# EAGLE design Rear ECU rev5 (EAGLE 8.4.1)
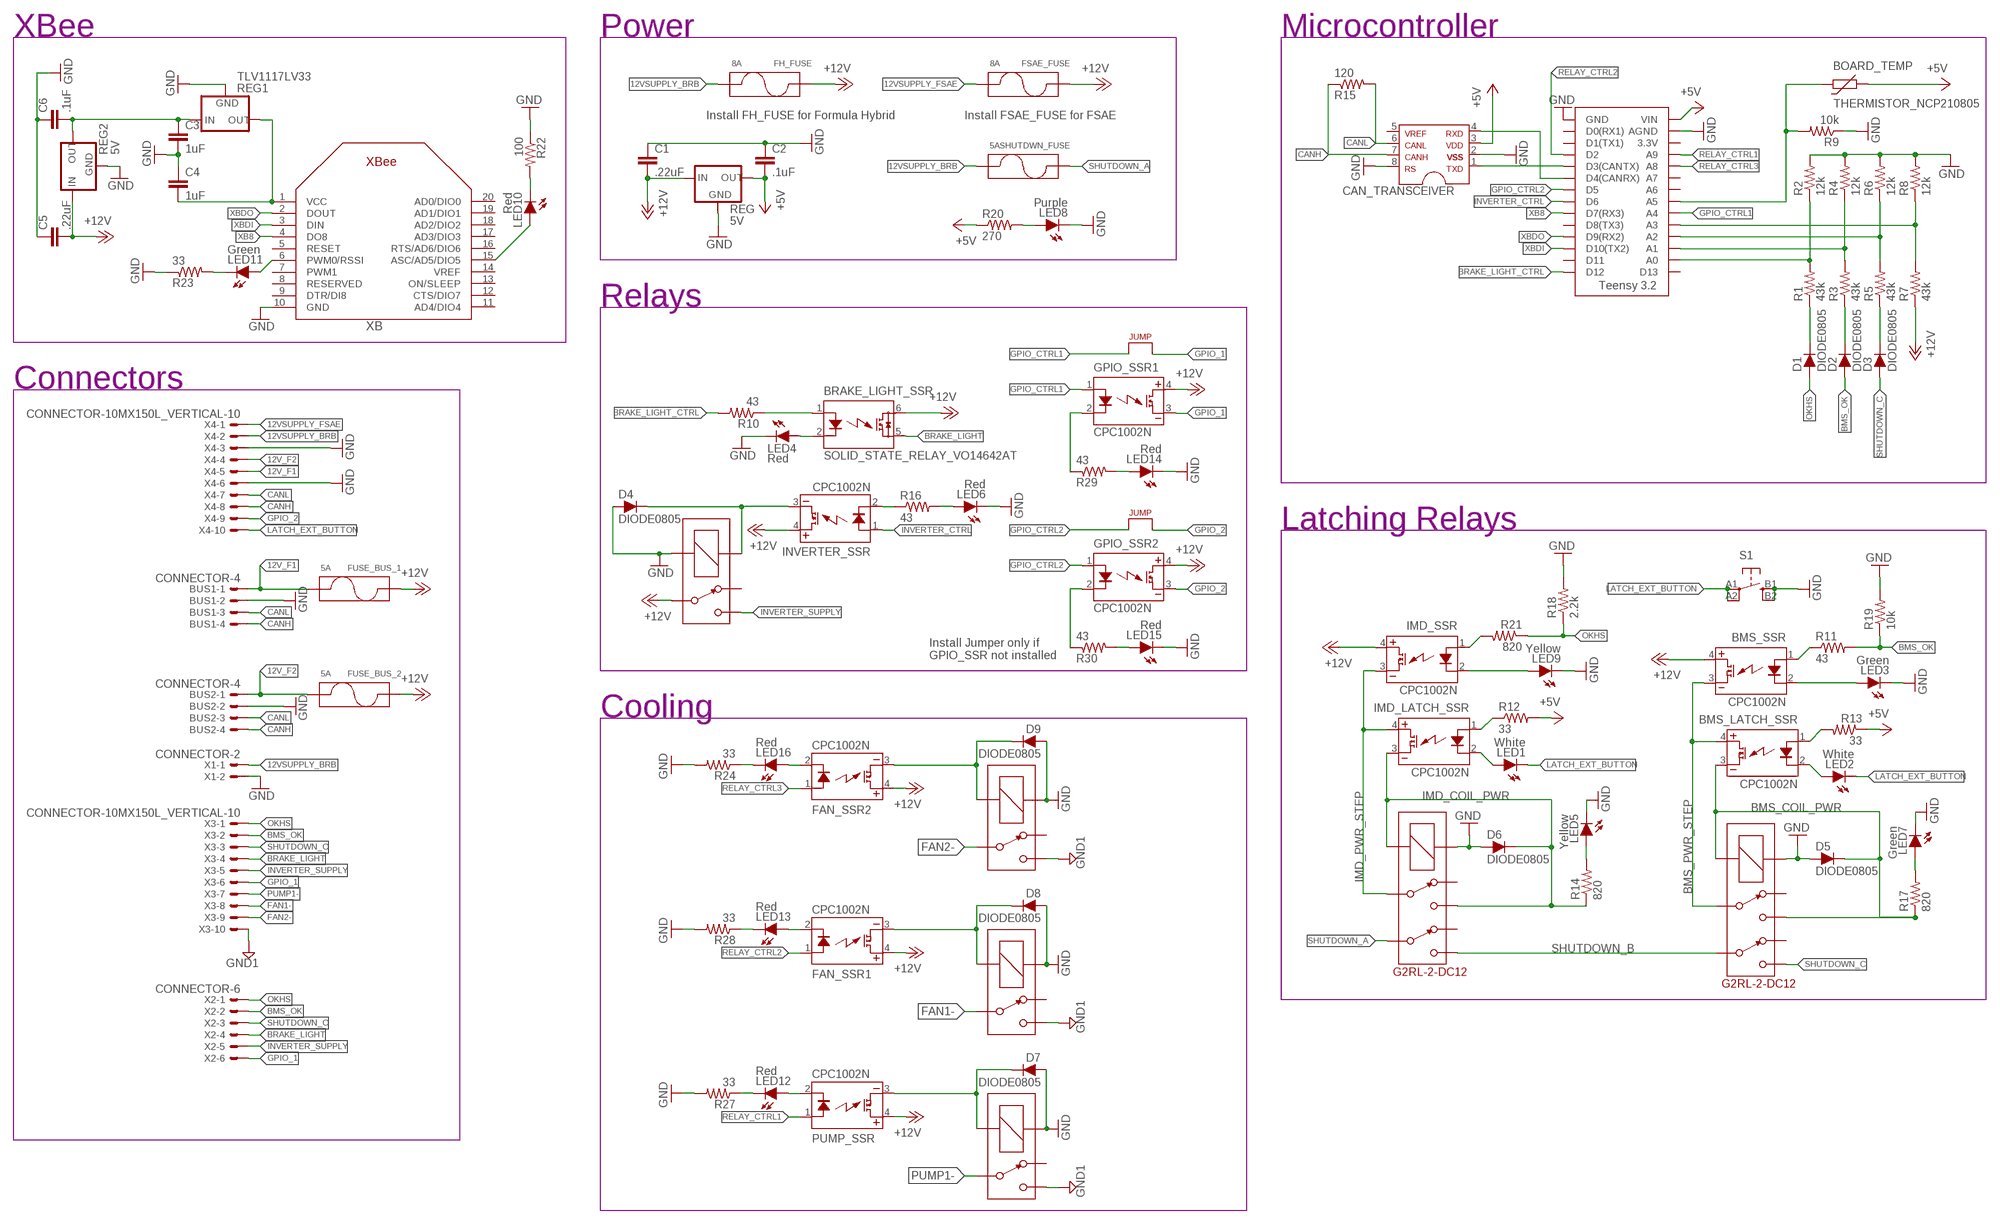
[diagram p0: schematic, sheet 1]

## Parts
BMS_LATCH_SSR  CPC1002N  [SOP04]
BMS_SSR  CPC1002N  [SOP04]
BOARD_TEMP  THERMISTOR_NCP210805  [0805]
BRAKE_LIGHT_SSR  SOLID_STATE_RELAY_VO14642AT  [DIL06]
BUS1  CONNECTOR-4  [MINIFIT_5566-4]
BUS2  CONNECTOR-4  [MINIFIT_5566-4]
C1  .22uF  CAP0805  [0805]
C2  .1uF  CAP0805  [0805]
C3  1uF  CAP0805  [0805]
C4  1uF  CAP0805  [0805]
C5  .22uF  CAP0805  [0805]
C6  .1uF  CAP0805  [0805]
CAN_TRANSCEIVER  MCP2551  [SOIC-08]
D1  DIODE0805  [0805_D]
D2  DIODE0805  [0805_D]
D3  DIODE0805  [0805_D]
D4  DIODE0805  [0805_D]
D5  DIODE0805  [0805_D]
D6  DIODE0805  [0805_D]
D7  DIODE0805  [0805_D]
D8  DIODE0805  [0805_D]
D9  DIODE0805  [0805_D]
FAN_SSR1  CPC1002N  [SOP04]
FAN_SSR2  CPC1002N  [SOP04]
FH_FUSE  8A  FUSE_MINIBLADE  [MINI-BLADE_FUSE_HOLDER]
FSAE_FUSE  8A  FUSE_MINIBLADE  [MINI-BLADE_FUSE_HOLDER]
FUSE_BUS_1  5A  FUSE_MINIBLADE  [MINI-BLADE_FUSE_HOLDER]
FUSE_BUS_2  5A  FUSE_MINIBLADE  [MINI-BLADE_FUSE_HOLDER]
GPIO_SSR1  CPC1002N  [SOP04]
GPIO_SSR2  CPC1002N  [SOP04]
IMD_LATCH_SSR  CPC1002N  [SOP04]
IMD_SHUTDOWN  G2RL-2-DC12  [G2RL-2]
IMD_SHUTDOWN1  G2RL-2-DC12  [G2RL-2]
IMD_SSR  CPC1002N  [SOP04]
INVERTER_SSR  CPC1002N  [SOP04]
LED1  White  LED-0805  [LED-805]
LED2  White  LED-0805  [LED-805]
LED3  Green  LED-0805  [LED-805]
LED4  Red  LED-0805  [LED-805]
LED5  Yellow  LED-0805  [LED-805]
LED6  Red  LED-0805  [LED-805]
LED7  Green  LED-0805  [LED-805]
LED8  Purple  LED-0805  [LED-805]
LED9  Yellow  LED-0805  [LED-805]
LED10  Red  LED-0805  [LED-805]
LED11  Green  LED-0805  [LED-805]
LED12  Red  LED-0805  [LED-805]
LED13  Red  LED-0805  [LED-805]
LED14  Red  LED-0805  [LED-805]
LED15  Red  LED-0805  [LED-805]
LED16  Red  LED-0805  [LED-805]
PUMP_SSR  CPC1002N  [SOP04]
R1  43k  RESISTOR0805-RES  [0805]
R2  12k  RESISTOR0805-RES  [0805]
R3  43k  RESISTOR0805-RES  [0805]
R4  12k  RESISTOR0805-RES  [0805]
R5  43k  RESISTOR0805-RES  [0805]
R6  12k  RESISTOR0805-RES  [0805]
R7  43k  RESISTOR0805-RES  [0805]
R8  12k  RESISTOR0805-RES  [0805]
R9  10k  RESISTOR0805-RES  [0805]
R10  43  RESISTOR0805-RES  [0805]
R11  43  RESISTOR0805-RES  [0805]
R12  33  RESISTOR0805-RES  [0805]
R13  33  RESISTOR0805-RES  [0805]
R14  820  RESISTOR0805-RES  [0805]
R15  120  RESISTOR0805-RES  [0805]
R16  43  RESISTOR0805-RES  [0805]
R17  820  RESISTOR0805-RES  [0805]
R18  2.2k  RESISTOR0805-RES  [0805]
R19  10k  RESISTOR0805-RES  [0805]
R20  270  RESISTOR0805-RES  [0805]
R21  820  RESISTOR0805-RES  [0805]
R22  100  RESISTOR0805-RES  [0805]
R23  33  RESISTOR0805-RES  [0805]
R24  33  RESISTOR0805-RES  [0805]
R27  33  RESISTOR0805-RES  [0805]
R28  33  RESISTOR0805-RES  [0805]
R29  43  RESISTOR0805-RES  [0805]
R30  43  RESISTOR0805-RES  [0805]
REG  5V  5V_REGULATOR_LM340-NLM340MPX-5.0/NOPB  [SOT223]
REG1  TLV1117LV33  [SOT223]
REG2  5V  5V_REGULATOR_LM340-NLM340MPX-5.0/NOPB  [SOT223]
S1  BTN_10-XXSMD  [TACTILE_SWITCH_SMD_6.2MM_TALL]
SHUTDWN_FUSE  5A  FUSE_MINIBLADE  [MINI-BLADE_FUSE_HOLDER]
U$1  G5LE  [ZF112]
U$2  G5LE  [ZF112]
U$3  TEENSY_3.2_SIMPLE  [TEENSY_3.2_SIMPLE]
U$6  G5LE  [ZF112]
U$7  G5LE  [ZF112]
U$10  JUMPER  [0805]
U$11  JUMPER  [0805]
X1  CONNECTOR-2  [MINIFIT_5566-2]
X2  CONNECTOR-6  [MINIFIT_5566-6]
X3  CONNECTOR-10MX150L_VERTICAL-10  [MX150L_VERTICAL-10]
X4  CONNECTOR-10MX150L_VERTICAL-10  [MX150L_VERTICAL-10]
XB  XBEE  [XBEE]

## Nets
12V_F1: BUS1.1 FUSE_BUS_1.R1(P2) FUSE_BUS_1.R2(P2) X4.5
12V_F2: BUS2.1 FUSE_BUS_2.R1(P2) FUSE_BUS_2.R2(P2) X4.4
12VSUPPLY_BRB: FH_FUSE.R1(P2) FH_FUSE.R2(P2) SHUTDWN_FUSE.R1(P2) SHUTDWN_FUSE.R2(P2) X1.1 X4.2
12VSUPPLY_FSAE: FSAE_FUSE.R1(P2) FSAE_FUSE.R2(P2) X4.1
12VSUPPLY_READ: R7.2 R8.1 U$3.A3
+5V: BOARD_TEMP.1 C2.2 CAN_TRANSCEIVER.3 R12.2 R13.1 R20.1 REG.3(OUT) U$3.VIN
+12V: BMS_SSR.4(DC+) BRAKE_LIGHT_SSR.6(IO1) C1.2 C5.2 FAN_SSR1.4(DC+) FAN_SSR2.4(DC+) FH_FUSE.L1(P1) FH_FUSE.L2(P1) FSAE_FUSE.L1(P1) FSAE_FUSE.L2(P1) FUSE_BUS_1.L1(P1) FUSE_BUS_1.L2(P1) FUSE_BUS_2.L1(P1) FUSE_BUS_2.L2(P1) GPIO_SSR1.4(DC+) GPIO_SSR2.4(DC+) IMD_SSR.4(DC+) INVERTER_SSR.4(DC+) PUMP_SSR.4(DC+) R7.1 REG2.1(IN) REG.1(IN) U$1.P
BMS_COIL_PWR: BMS_LATCH_SSR.3(DC-) D5.C IMD_SHUTDOWN1.4 IMD_SHUTDOWN1.COIL- R17.1
BMS_OK: D2.A R11.2 R19.1 X2.2 X3.2
BMS_OK_READ: R3.2 R4.1 U$3.A1
BMS_PWR_STEP: BMS_LATCH_SSR.4(DC+) BMS_SSR.3(DC-) IMD_SHUTDOWN1.3
BRAKE_LIGHT: BRAKE_LIGHT_SSR.5(IO2) X2.4 X3.4
BRAKE_LIGHT_CTRL: R10.2 U$3.D12
CANH: BUS1.4 BUS2.4 CAN_TRANSCEIVER.7 R15.1 X4.8
CANL: BUS1.3 BUS2.3 CAN_TRANSCEIVER.6 R15.2 X4.7
FAN1-: U$7.P X3.8
FAN2-: U$2.P X3.9
GND: BUS1.2 BUS2.2 C1.1 C2.1 C3.2 C4.1 C5.1 C6.1 CAN_TRANSCEIVER.2 CAN_TRANSCEIVER.8 D4.A D5.A D6.A D7.A D8.A D9.A IMD_SHUTDOWN1.COIL+ IMD_SHUTDOWN.COIL+ LED3.C LED4.C LED5.C LED6.C LED7.C LED8.C LED9.C LED14.C LED15.C R2.2 R4.2 R6.2 R8.2 R9.1 R18.2 R19.2 R22.1 R23.1 R24.2 R27.2 R28.2 REG1.1(GND) REG2.2(GND) REG2.4(GND) REG.2(GND) REG.4(GND) S1.B1(S) S1.B2(S1) U$1.2(COIL-) U$2.1(COIL+) U$3.AGND U$3.GND U$6.1(COIL+) U$7.1(COIL+) X1.2 X4.3 X4.6 XB.10(GND)
GND1: U$2.S U$6.S U$7.S X3.10
GPIO_1: GPIO_SSR1.3(DC-) U$10.2 X2.6 X3.6
GPIO_2: GPIO_SSR2.3(DC-) U$11.2 X4.9
GPIO_CTRL1: GPIO_SSR1.1(CONTROL+) U$3.A4 U$10.1
GPIO_CTRL2: GPIO_SSR2.1(CONTROL+) U$3.D5 U$11.1
IMD_COIL_PWR: D6.C IMD_LATCH_SSR.3(DC-) IMD_SHUTDOWN.4 IMD_SHUTDOWN.COIL- R14.1
IMD_PWR_STEP: IMD_LATCH_SSR.4(DC+) IMD_SHUTDOWN.3 IMD_SSR.3(DC-)
INVERTER_CTRL: INVERTER_SSR.1(CONTROL+) U$3.D6
INVERTER_SUPPLY: U$1.S X2.5 X3.5
LATCH_EXT_BUTTON: LED1.C LED2.C S1.A1(P) S1.A2(P1) X4.10
N$1: IMD_LATCH_SSR.2(CONTROL-) LED1.A
N$2: CAN_TRANSCEIVER.4 U$3.D4(CANRX)
N$3: CAN_TRANSCEIVER.1 U$3.D3(CANTX)
N$4: D7.C PUMP_SSR.3(DC-) U$6.2(COIL-)
N$5: IMD_LATCH_SSR.1(CONTROL+) R12.1
N$6: GPIO_SSR1.2(CONTROL-) R29.1
N$7: BRAKE_LIGHT_SSR.2(LED-) LED4.A
N$8: GPIO_SSR2.2(CONTROL-) R30.1
N$9: BMS_SSR.2(CONTROL-) LED3.A
N$10: LED10.A XB.15(ASC/AD5/DIO5)
N$11: LED10.C R22.2
N$12: BMS_LATCH_SSR.1(CONTROL+) R13.2
N$13: LED14.A R29.2
N$14: LED15.A R30.2
N$15: BOARD_TEMP.2 R9.2 U$3.A5
N$16: BMS_LATCH_SSR.2(CONTROL-) LED2.A
N$17: BRAKE_LIGHT_SSR.1(LED+) R10.1
N$18: BMS_SSR.1(CONTROL+) R11.1
N$19: LED5.A R14.2
N$20: D8.C FAN_SSR1.3(DC-) U$7.2(COIL-)
N$21: D9.C FAN_SSR2.3(DC-) U$2.2(COIL-)
N$22: D1.C R1.1
N$23: D2.C R3.1
N$24: D3.C R5.1
N$25: LED11.A XB.6(PWM0/RSSI)
N$26: D4.C INVERTER_SSR.3(DC-) U$1.1(COIL+)
N$27: INVERTER_SSR.2(CONTROL-) R16.1
N$28: LED6.A R16.2
N$29: LED8.A R20.2
N$30: LED16.C R24.1
N$31: IMD_SSR.1(CONTROL+) R21.2
N$32: LED7.A R17.2
N$33: LED11.C R23.2
N$34: IMD_SSR.2(CONTROL-) LED9.A
N$35: C3.1 C6.2 REG1.3(IN) REG2.3(OUT)
N$36: LED13.C R28.1
N$37: LED12.C R27.1
N$38: LED12.A PUMP_SSR.2(CONTROL-)
N$39: FAN_SSR2.2(CONTROL-) LED16.A
N$42: FAN_SSR1.2(CONTROL-) LED13.A
OKHS: D1.A R18.1 R21.1 X2.1 X3.1
OKHS_READ: R1.2 R2.1 U$3.A0
PUMP1-: U$6.P X3.7
RELAY_CTRL1: PUMP_SSR.1(CONTROL+) U$3.A9
RELAY_CTRL2: FAN_SSR1.1(CONTROL+) U$3.D2
RELAY_CTRL3: FAN_SSR2.1(CONTROL+) U$3.A8
SHUTDOWN_A: IMD_SHUTDOWN.6 SHUTDWN_FUSE.L1(P1) SHUTDWN_FUSE.L2(P1)
SHUTDOWN_B: IMD_SHUTDOWN1.6 IMD_SHUTDOWN.5
SHUTDOWN_C: D3.A IMD_SHUTDOWN1.5 X2.3 X3.3
SHUTDOWN_OUT_READ: R5.2 R6.1 U$3.A2
VCC: C4.2 REG1.2(OUT) REG1.4(OUT) XB.1(VCC)
XB8: U$3.D7(RX3) XB.4(DO8)
XBDI: U$3.D10(TX2) XB.3(DIN)
XBDO: U$3.D9(RX2) XB.2(DOUT)
Unconnected: CAN_TRANSCEIVER.5 IMD_SHUTDOWN1.2 IMD_SHUTDOWN1.7 IMD_SHUTDOWN.2 IMD_SHUTDOWN.7 U$1.O U$2.O U$3.3.3V U$3.A6 U$3.A7 U$3.D0(RX1) U$3.D1(TX1) U$3.D8(TX3) U$3.D11 U$3.D13 U$6.O U$7.O XB.5(RESET) XB.7(PWM1) XB.8(RESERVED) XB.9(DTR/DI8) XB.11(AD4/DIO4) XB.12(CTS/DIO7) XB.13(ON/SLEEP) XB.14(VREF) XB.16(RTS/AD6/DIO6) XB.17(AD3/DIO3) XB.18(AD2/DIO2) XB.19(AD1/DIO1) XB.20(AD0/DIO0)

## Notes on the sheet
- XBee | Power | Microcontroller
- Install FH_FUSE for Formula Hybrid | Install FSAE_FUSE for FSAE
- Relays
- Connectors
- Latching Relays
- Install Jumper only if
  GPIO_SSR not installed
- Cooling

## Library data of the parts
BMS_LATCH_SSR BMS_SSR FAN_SSR1 FAN_SSR2 GPIO_SSR1 GPIO_SSR2 IMD_LATCH_SSR IMD_SSR INVERTER_SSR PUMP_SSR = HyTechDevices:CPC1002N: IXYS Solid State Relay .7A
BOARD_TEMP = HyTechDevices:THERMISTOR_NCP21: Murata NCP Thermistor Datasheet
BRAKE_LIGHT_SSR = HyTechDevices:SOLID_STATE_RELAY
BUS1 BUS2 = HyTechDevices:CONNECTOR-4: Mini-Fit Junior connector 4 pole Source: http://www.molex.com; OC_FARNELL: unknown; OC_NEWARK: unknown
C1-C6 = HyTechDevices:CAP: Capacitor Standard 0603 ceramic capacitor, and 0.1" leaded capacitor.
CAN_TRANSCEIVER = HyTechDevices:MCP2551: MCP2551 High-Speed CAN Transceiver Product Webpage Datasheet This device is outdated It is replaced by MCP2561. Comparison Page Product Webpage Datasheet
D1-D9 = HyTechDevices:DIODE: DIODE general purpose rectifier
FH_FUSE FSAE_FUSE FUSE_BUS_1 FUSE_BUS_2 SHUTDWN_FUSE = HyTechDevices:FUSE: Fuse/Fuseclips Keystone Electronics 3568 Fuse Mouser Part <http://www.mouser.com/ProductDetail/Keystone-Electronics/3568> Datasheet <http://www.mouser.com/ds/2/215/568-742601.pdf> Bussman/Eaton Midget Fuse Clip 1A3400 <http://www.mouser.com/ProductDetail/Bussmann-Eaton/BK-1A3400-09-R/?qs=sGAEpiMZZMuG%252bgnN5hGYGzzlAelq2OxnKqVSMVjq8I4%3d> Schurter 0751.0110 Brass Fuse Clip Datasheet <http://www.mouser.com/ds/2/358/typ_OG__Clip__5x20-2553.pdf>
IMD_SHUTDOWN IMD_SHUTDOWN1 = HyTechDevices:G2RL-2-DC12: Omron G2RL-2 Double Pull Double Throw Relay Coil Voltage: 12VDC (8.4-18VDC @60ºC) Contact Amperage: 8A at 30VDC Datasheet
LED1-LED16 = HyTechDevices:LED: Light Emitting Diode (LED) Source: Dangerous Prototypes Eagle Library
R1-R24 R27-R30 = HyTechDevices:RESISTOR: Resistor Basic schematic elements and footprints for 0603, 1206, and PTH resistors.
REG REG2 = HyTechDevices:5V_REGULATOR_LM340-N: Voltage Regulator 5v linear voltage regulator Datasheet MAX current out: 1.5A MAX voltage in: 35V
REG1 = HyTechDevices:TLV1117LV33: Texas Instruments TLV1117LV33 3.3V Linear Regulator
S1 = HyTechDevices:BTN_10-XX: Small momentary tactile push button
U$1 U$2 U$6 U$7 = HyTechDevices:G5LE: Omron G5LE SPST Relay 5 VDC, 12VDC, 24VDC models Coil voltage: 75% - 170% of nominal voltage Datasheet
U$3 = HyTechDevices:TEENSY_3.2_SIMPLE: Simple version of the Teensy 3.2 board that only uses the 2 main rows of pins, not the inner pins or the pins opposite the usb port.
U$10 U$11 = HyTechDevices:JUMPER: Jumper for changing operation of a device
X1 = HyTechDevices:CONNECTOR-2: Mini-Fit Junior connector 2 pole Source: http://www.molex.com; OC_FARNELL: 1822072; OC_NEWARK: unknown
X2 = HyTechDevices:CONNECTOR-6: Mini-Fit Junior connector 6 pole Source: http://www.molex.com; MPN: 95566-61002; OC_FARNELL: unknown; OC_NEWARK: 22K8620
X3 X4 = HyTechDevices:CONNECTOR-10: Mini-Fit Junior connector 10 pole Source: http://www.molex.com
XB = HyTechDevices:XBEE: Source: Adafruit

## Board
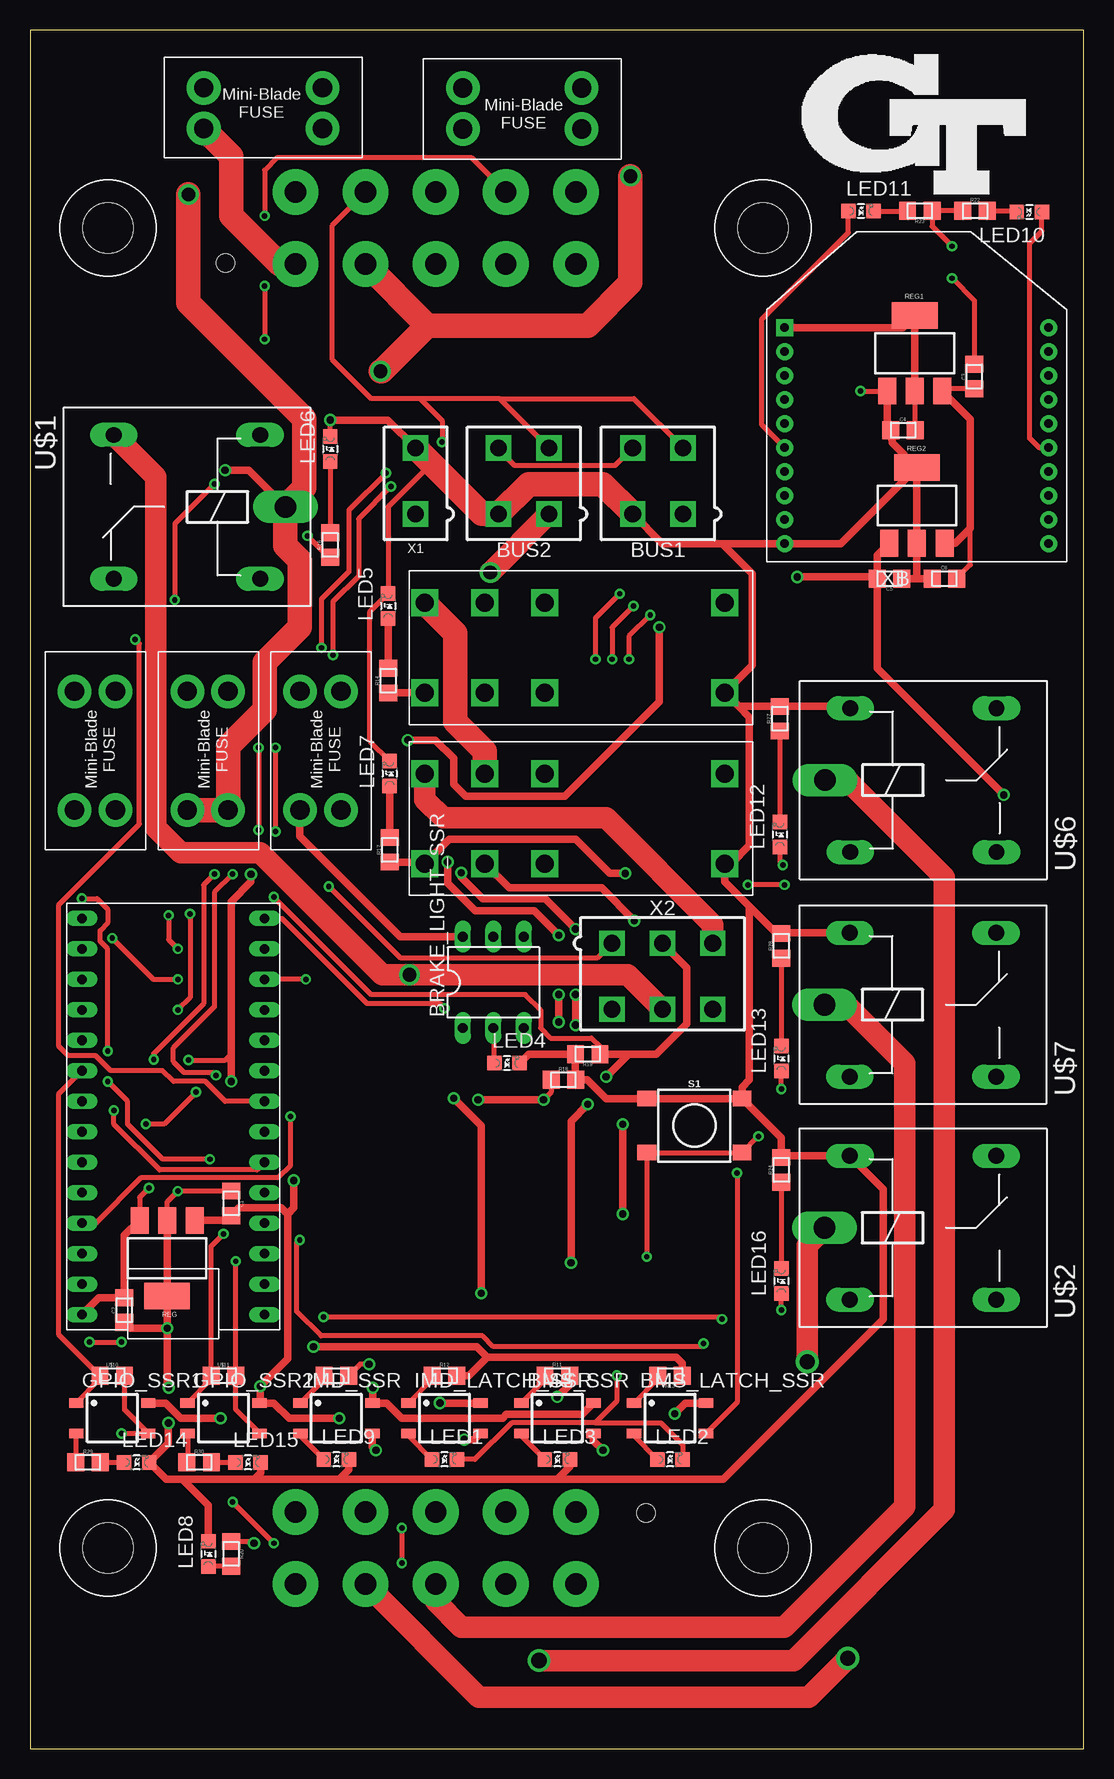
[diagram p1: board, top side]
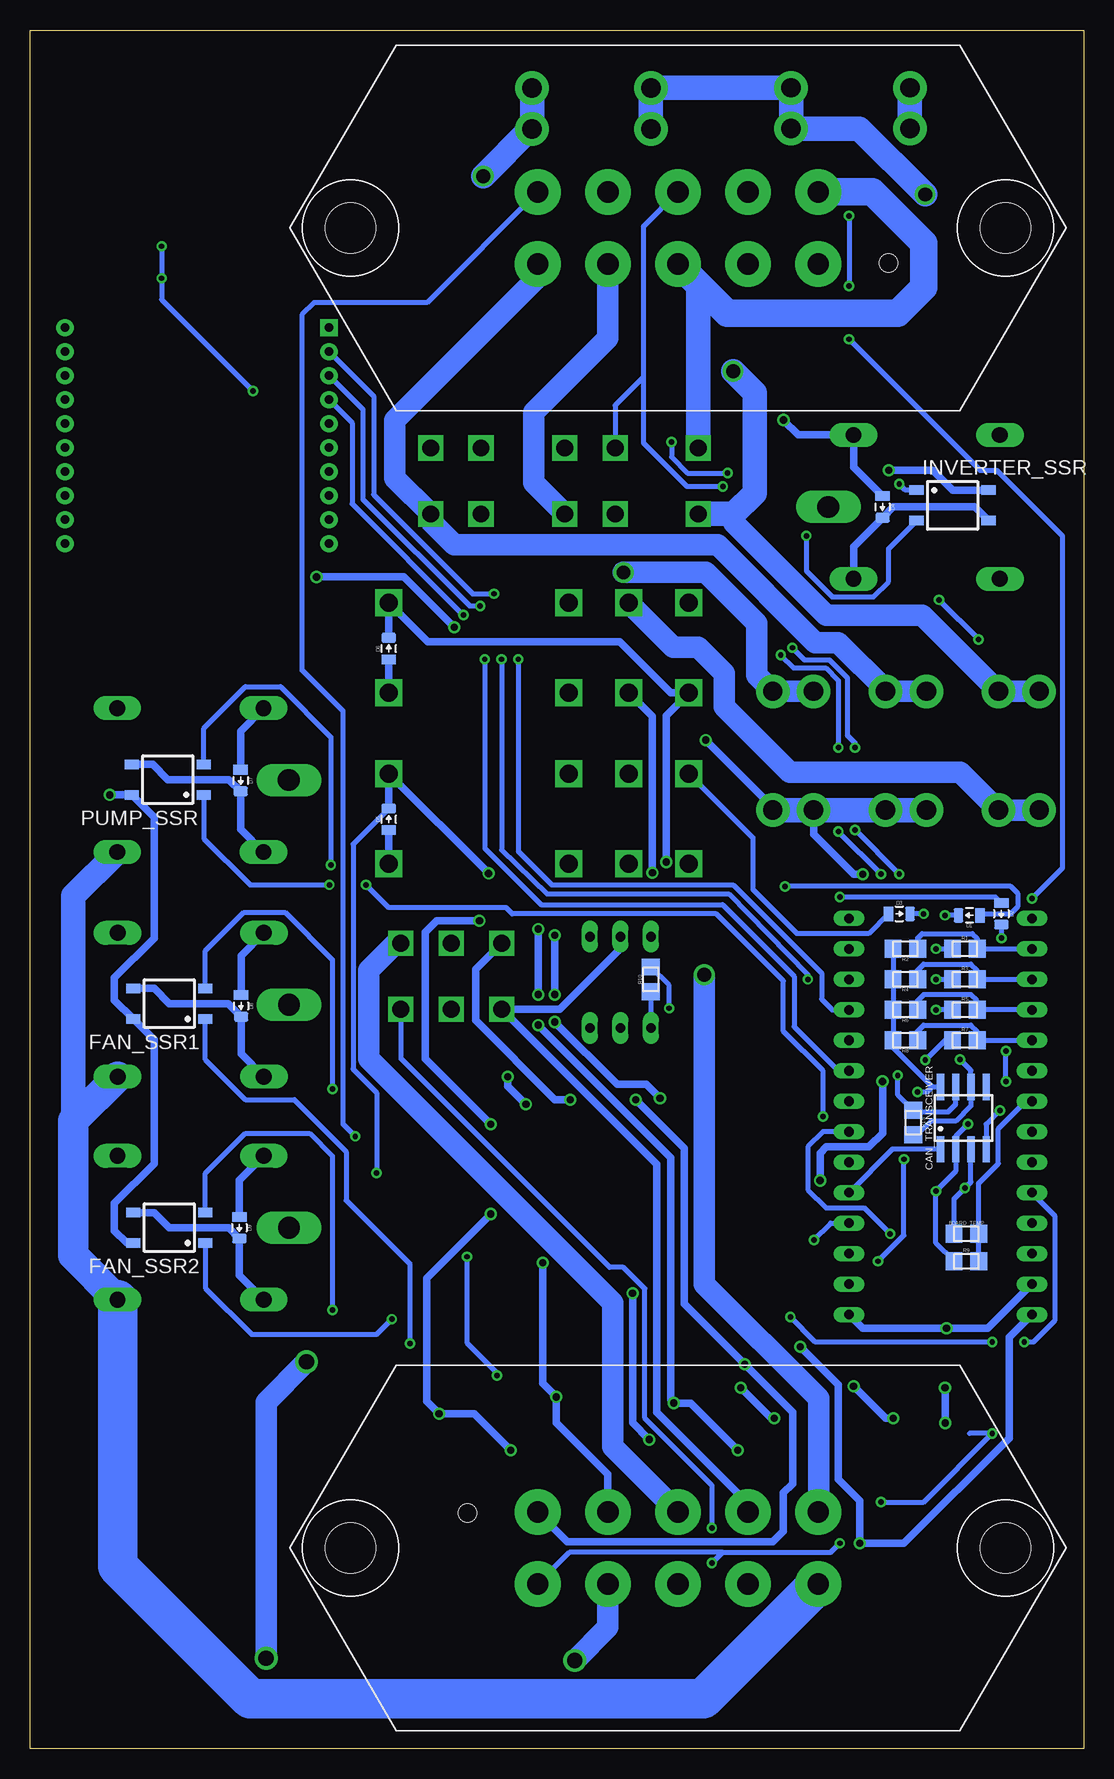
[diagram p2: board, bottom side, seen from below]

Size 87.81 x 143.25 mm. Coordinates in mm from the lower left corner, seen from the top.
Outline: 0,0 87.81,0 87.81,143.25 0,143.25 0,0
Copper layers (1*16): Top 0.035mm / dielectric 1.5mm / Bottom 0.035mm
Design rules "DRC Advanced Circuits": minimum track width 10mil, minimum drill 15mil, track to track 6mil, track to pad 6mil, pad to pad 6mil, via to via 6mil, smd to smd 6mil, copper to edge 40mil, drill to drill 6mil, minimum pad ring 10mil, minimum via ring 8mil, stop-mask expansion 4mil, vias tented up to drill 0mil, thermal gap 10mil

### Footprints (pad centres in the part's own frame; a part is rotated, then mirrored left to right if it is on the bottom)
SOP04 = smd 0.8 x 1.2: 1 -1.27,-3; 2 1.27,-3; 3 1.27,3; 4 -1.27,3
0805 = smd 1.4 x 1.5: 1 -1.025,0; 2 1.025,0
DIL06 = drill 0.813 long: 1 -2.54,-3.81; 2 0,-3.81; 3 2.54,-3.81; 4 2.54,3.81; 5 0,3.81; 6 -2.54,3.81
MINIFIT_5566-4 = drill 1.4 square: 1 2.1,-2.75; 2 -2.1,-2.75; 3 2.1,2.75; 4 -2.1,2.75
SOIC-08 = smd 0.6 x 2.2: 1 -1.905,-2.6; 2 -0.635,-2.6; 3 0.635,-2.6; 4 1.905,-2.6; 5 1.905,2.6; 6 0.635,2.6; 7 -0.635,2.6; 8 -1.905,2.6
0805_D = smd 0.8 x 1.2: A -0.9,0; C 0.9,0
MINI-BLADE_FUSE_HOLDER = drill 1.613 pad 2.794: L1 0,3.404; L2 0,0; R1 9.906,3.404; R2 9.906,0
G2RL-2 = drill 1.5 square: 2 10.008,0; 3 5.004,0; 4 0,0; 5 0,7.493; 6 5.004,7.493; 7 10.008,7.493; COIL+ 25.019,0; COIL- 25.019,7.493
LED-805 = smd 1.2 x 1.2: A 0,-1.05; C 0,1.05
SOT223 = smd 1.5 x 2.235: 1 -2.3,-3.15; 2 0,-3.15; 3 2.3,-3.15 | smd 3.8 x 2.2: 4 0,3.15
TACTILE_SWITCH_SMD_6.2MM_TALL = smd 1.55 x 1.3: A1 -3.975,-2.25; A2 3.975,-2.25; B1 -3.975,2.25; B2 3.975,2.25
ZF112 = drill 1.321 long: 1 4.064,14.884; 2 4.064,2.896; O 16.256,14.884; S 16.256,2.896 | drill 1.803 long: P 1.956,8.89
TEENSY_3.2_SIMPLE = drill 0.8 long: 3.3V 16.51,29.21; A0 16.51,3.81; A1 16.51,6.35; A2 16.51,8.89; A3 16.51,11.43; A4 16.51,13.97; A5 16.51,16.51; A6 16.51,19.05; A7 16.51,21.59; A8 16.51,24.13; A9 16.51,26.67; AGND 16.51,31.75; D0(RX1) 1.27,31.75; D1(TX1) 1.27,29.21; D2 1.27,26.67; D3(CANTX) 1.27,24.13; D4(CANRX) 1.27,21.59; D5 1.27,19.05; D6 1.27,16.51; D7(RX3) 1.27,13.97; D8(TX3) 1.27,11.43; D9(RX2) 1.27,8.89; D10(TX2) 1.27,6.35; D11 1.27,3.81; D12 1.27,1.27; D13 16.51,1.27; GND 1.27,34.29; VIN 16.51,34.29
MINIFIT_5566-2 = drill 1.4 square: 1 0,-2.75; 2 0,2.75
MINIFIT_5566-6 = drill 1.4 square: 1 4.2,-2.75; 2 0,-2.75; 3 -4.2,-2.75; 4 4.2,2.75; 5 0,2.75; 6 -4.2,2.75
MX150L_VERTICAL-10 = drill 1.778 pad 3.81: 1 -11.684,2.997; 2 -5.842,2.997; 3 0,2.997; 4 5.842,2.997; 5 11.684,2.997; 6 -11.684,-2.997; 7 -5.842,-2.997; 8 0,-2.997; 9 5.842,-2.997; 10 11.684,-2.997 | hole 4.191: -27.292,0; 27.292,0 | hole 1.524: -17.526,2.921
XBEE = drill 0.7 pad 1.422 square: 1 -11,5.5 | drill 0.7 pad 1.422: 2 -11,3.5; 3 -11,1.5; 4 -11,-0.5; 5 -11,-2.5; 6 -11,-4.5; 7 -11,-6.5; 8 -11,-8.5; 9 -11,-10.5; 10 -11,-12.5; 11 11,-12.5; 12 11,-10.5; 13 11,-8.5; 14 11,-6.5; 15 11,-4.5; 16 11,-2.5; 17 11,-0.5; 18 11,1.5; 19 11,3.5; 20 11,5.5

### Placement (x,y rotation side)
BMS_LATCH_SSR  53.34,27.56 270 top
BMS_SSR  43.94,27.56 270 top
BOARD_TEMP  9.78,42.93 0 bottom
BRAKE_LIGHT_SSR  38.61,63.88 0 top
BUS1  52.32,105.66 0 top
BUS2  41.15,105.66 0 top
C1  16.76,45.47 270 top
C2  7.87,36.58 90 top
C3  78.7,114.37 90 top
C4  72.76,109.89 0 top
C5  71.63,97.54 180 top
C6  76.2,97.54 0 top
CAN_TRANSCEIVER  10.03,52.58 0 bottom
D1  9.53,69.47 180 bottom
D2  6.86,69.6 270 bottom
D3  15.37,69.6 0 bottom
D4  16.76,103.5 270 bottom
D5  57.91,77.47 90 bottom
D6  57.91,91.69 90 bottom
D7  70.25,80.7 270 bottom
D8  70.22,61.92 270 bottom
D9  70.36,43.43 270 bottom
FAN_SSR1  76.2,62.1 90 bottom
FAN_SSR2  76.2,43.43 90 bottom
FH_FUSE  36.07,135 0 top
FSAE_FUSE  24.38,138.43 180 top
FUSE_BUS_1  16.51,78.23 90 top
FUSE_BUS_2  25.91,78.23 90 top
GPIO_SSR1  6.86,27.56 270 top
GPIO_SSR2  16.13,27.56 270 top
IMD_LATCH_SSR  34.54,27.56 270 top
IMD_SHUTDOWN  32.89,88.01 0 top
IMD_SHUTDOWN1  32.89,73.79 0 top
IMD_SSR  25.53,27.56 270 top
INVERTER_SSR  10.92,103.63 270 bottom
LED1  34.54,24.13 270 top
LED2  53.34,24.13 270 top
LED3  43.94,24.13 270 top
LED4  39.75,57.15 270 top
LED5  29.84,95.25 0 top
LED6  25.02,108.33 0 top
LED7  29.97,81.28 0 top
LED8  14.86,16.26 0 top
LED9  25.53,24.13 270 top
LED10  83.28,128.08 90 top
LED11  69.25,128.16 270 top
LED12  62.48,76.2 0 top
LED13  62.61,57.53 0 top
LED14  8.89,23.88 270 top
LED15  18.16,23.88 270 top
LED16  62.61,38.99 0 top
PUMP_SSR  76.33,80.77 90 bottom
R1  9.91,66.67 0 bottom
R2  14.86,66.67 180 bottom
R3  9.91,64.14 0 bottom
R4  14.86,64.14 180 bottom
R5  9.91,61.59 0 bottom
R6  14.86,61.59 180 bottom
R7  9.91,59.05 0 bottom
R8  14.86,59.05 180 bottom
R9  9.78,40.64 0 bottom
R10  36.07,64.14 90 bottom
R11  43.94,31.11 0 top
R12  34.54,31.11 0 top
R13  53.34,31.11 180 top
R14  29.84,89.03 90 top
R15  14.22,52.2 270 bottom
R16  25.02,100.33 90 top
R17  29.97,74.93 90 top
R18  44.45,55.75 0 top
R19  46.48,57.91 180 top
R20  16.76,16.26 270 top
R21  25.53,31.11 180 top
R22  78.76,128.18 0 top
R23  74.15,128.17 180 top
R24  62.61,48.26 90 top
R27  62.48,85.85 90 top
R28  62.61,66.93 90 top
R29  4.83,23.88 0 top
R30  14.1,23.88 0 top
REG  11.43,40.89 180 top
REG1  73.72,116.31 0 top
REG2  73.91,103.63 0 top
S1  55.37,51.94 0 top
SHUTDWN_FUSE  7.11,78.23 90 top
U$1  23.24,112.39 180 top
U$2  64.26,34.54 0 top
U$3  20.83,70.48 180 top
U$6  64.29,71.85 0 top
U$7  64.25,53.13 0 top
U$10  6.86,31.11 0 top
U$11  16.13,31.11 0 top
X1  32.13,105.66 0 top
X2  52.7,64.39 180 top
X3  33.81,16.75 0 bottom
X4  33.81,126.75 180 bottom
XB  73.89,112.94 0 top

### Tracks (layer width: path | path; a pad name or v marks a point on that pad's centre or on a via)
12V_F1
  Bottom 1.778: X4.5 45.49,122.65 57.4,110.74 57.4,105.89 BUS1.1 54.42,102.3 52.45,100.33 30.48,100.33 22.35,92.2 20.45,92.2 16.51,88.27 FUSE_BUS_1.R2 FUSE_BUS_1.R1
12V_F2  (via drill 1.14)
  Top 1.778: BUS2.1 38.38,98.04 v38.35,98.04
  Bottom 1.778: BUS2.1 45.85,105.51 45.85,111.38 39.65,117.57 X4.4 | FUSE_BUS_2.R1 FUSE_BUS_2.R2 27.24,89.47 27.24,93.79 31.5,98.04 v38.35,98.04
12VSUPPLY_BRB  (via drill 1.14)
  Top 2.032: v50.04,131.06 50.04,122.17 46.48,118.62 33.1,118.62 | X4.2 33.1,118.62 | 33.1,118.62 29.29,114.81 v29.21,114.81
  Bottom 1.778: X4.2 28,123.72 | SHUTDWN_FUSE.R1 SHUTDWN_FUSE.R2 13.46,94.49 21.46,94.49 29.17,102.19 29.17,102.91
  Bottom 2.032: FH_FUSE.R1 FH_FUSE.R2 46.1,135 v50.04,131.06 | v29.21,114.81 27.43,113.03 27.43,104.65 29.17,102.91 X1.1
12VSUPPLY_FSAE
  Top 2.032: X4.1 20.77,123.75 16.76,127.76 16.76,132.74 FSAE_FUSE.R1
  Bottom 2.032: FSAE_FUSE.R2 FSAE_FUSE.R1
12VSUPPLY_READ
  Bottom 0.406: R8.1 13.84,59.06 13.84,59.82 13.34,60.33 9.4,60.33 8.88,59.81 R7.2 U$3.A3
+5V  (via drill 0.45, 0.6)
  Top 0.406: REG.3 9.13,45.96 v9.91,46.74 | 17.01,17.28 R20.1 18.53,17.28 v18.67,17.14
  Top 0.61: REG.3 7.87,42.79 C2.2 5.72,37.6 U$3.VIN | R13.1 54.36,31.12 54.36,32.13 53.85,32.64 38.1,32.64 | 38.1,32.64 36.58,31.11 R12.2 | 38.1,32.64 37.21,33.53 v23.62,33.53
  Bottom 0.406: BOARD_TEMP.1 10.8,45.84 v9.91,46.74 9.4,47.24 CAN_TRANSCEIVER.3
  Bottom 0.61: v23.62,33.53 20.45,30.35 20.45,22.48 18.67,20.7 v18.67,17.14 14.99,17.14 6.22,25.91 6.22,34.29 U$3.VIN
+12V  (via drill 0.45, 0.6, 1.14)
  Top 0.406: v13.21,57.4 16.26,57.4 16.76,57.91 16.76,58.04
  Top 0.61: REG2.1 70.6,99.47 C5.2 | v16.26,106.55 18.24,106.55 U$1.P | GPIO_SSR1.4 11.3,28.83 12.57,27.56 v15.88,27.56 | v25.78,27.56 21.59,27.56 20.32,28.83 GPIO_SSR2.4 19.18,28.88 v19.18,30.23 21.46,32.51 21.46,44.58 | v28.57,30.1 28.57,28.88 IMD_SSR.4 29.72,28.83 30.99,27.56 39.38,27.56 39.71,27.89 46,27.89 BMS_SSR.4 | C5.2 70.61,97.53 70.61,90.04 v81.15,79.5 | v63.93,97.66 70.48,97.66 C5.2 | FUSE_BUS_2.L1 22.48,78.21 22.48,76.07 30.86,67.69 BRAKE_LIGHT_SSR.6 | 21.46,44.58 20.95,45.09 17.41,45.09 C1.2 16.37,44.04 REG.1 | v16.76,55.63 16.76,58.04 16.76,70.61 18.41,72.26 v18.41,72.9 | v21.97,47.37 21.97,45.09 21.46,44.58 | v52.45,93.47 52.45,87.25 44.58,79.38 36.32,79.38 35.31,80.39 35.31,82.55 33.78,84.07 v31.5,84.07
  Top 2.032: FUSE_BUS_1.L1 FUSE_BUS_1.L2 16.51,83.57 19.56,86.61 19.56,90.55 22.48,93.47 22.48,99.06 21.29,100.25 U$1.P 22.86,105.08 22.86,110.87 13.21,120.52 v13.21,129.54
  Bottom 0.406: R7.1 11.56,59.05 v13.21,57.4
  Bottom 0.61: INVERTER_SSR.4 10.92,104.9 12.57,106.55 v16.26,106.55 | v15.88,27.56 16.51,27.56 v19.18,30.23 | v25.78,27.56 26.04,27.56 v28.57,30.1 | v81.15,79.5 PUMP_SSR.4 77.47,77.64 77.47,67.56 80.77,64.26 80.77,62.41 FAN_SSR1.4 77.47,59.1 77.47,48.77 80.77,45.47 80.77,43.18 79.76,42.16 FAN_SSR2.4 | v16.76,55.63 16.76,51.31 17.91,50.16 21.46,50.16 21.97,49.66 v21.97,47.37 | v52.45,93.47 56.64,97.66 v63.93,97.66 | v18.41,72.9 19.18,72.9 22.5,76.22 FUSE_BUS_2.L1 | v31.5,84.07 25.91,78.49 FUSE_BUS_2.L2
  Bottom 1.778: 13.08,78.23 FUSE_BUS_1.L1
  Bottom 2.032: FH_FUSE.L2 FH_FUSE.L1 36.04,138.43 FSAE_FUSE.L2 FSAE_FUSE.L1 18.69,135.03 v13.21,129.54 | FUSE_BUS_2.L2 FUSE_BUS_2.L1 FUSE_BUS_1.L2 13.08,78.23
BMS_COIL_PWR  (via drill 0.45, 0.6)
  Top 0.406: v58.93,48.01 58.93,28.88 BMS_LATCH_SSR.3
  Top 0.61: R17.1 32.77,73.91 IMD_SHUTDOWN1.4 34.92,75.82 45.47,75.82 48.32,72.96 v49.59,72.96
  Bottom 0.406: D5.C 60.89,75.39 60.89,56.64 58.93,54.68 v58.93,48.01
  Bottom 0.61: D5.C IMD_SHUTDOWN1.COIL- v49.59,72.96
BMS_OK  (via drill 0.45, 0.6)
  Top 0.406: v20.32,70.99 28.45,62.87 41.27,62.87 42.55,61.59 42.55,60.07 43.37,59.24 46.8,59.24 47.51,58.54 R19.1
  Top 0.61: X2.2 54.74,65.11 54.74,60.45 52.2,57.91 49.91,57.91 | 49.91,57.91 R19.1 | v43.94,29.34 44.97,30.36 R11.2 | v46.48,53.72 45.09,52.32 v45.09,40.51 | v48.01,56.01 49.91,57.91
  Bottom 0.406: D2.A 7.36,70.99 v20.32,70.99
  Bottom 0.61: X3.2 39.65,22.89 43.94,27.18 v43.94,29.34 45.09,30.48 v45.09,40.51 | v46.48,53.72 48.01,55.24 v48.01,56.01
BMS_OK_READ
  Bottom 0.406: R4.1 13.83,64.91 13.34,65.41 9.4,65.41 8.88,64.89 R3.2 U$3.A1
BMS_PWR_STEP  (via drill 0.6)
  Top 0.61: BMS_LATCH_SSR.4 54.61,28.83 v53.72,27.94 | v47.75,24.89 46.94,25.7 BMS_SSR.3 | v49.4,44.58 v49.4,52.07 | IMD_SHUTDOWN1.3 39.93,71.75 47.62,71.75 v50.35,69.03
  Bottom 0.61: v47.75,24.89 50.8,27.94 v53.72,27.94 54.74,28.96 54.74,39.24 v49.4,44.58 | v50.35,69.03 53.91,69.03 54.86,68.07 54.86,57.53 v49.4,52.07
BRAKE_LIGHT
  Bottom 0.61: BRAKE_LIGHT_SSR.5 38.61,66.67 43.64,61.64 X2.4 35.58,48.72 35.58,28.04 27.97,20.43 X3.4
BRAKE_LIGHT_CTRL  (via drill 0.45)
  Top 0.406: U$3.D12 20.98,69.22 28.07,62.13 34.14,62.13 v34.54,61.72
  Bottom 0.406: v34.54,61.72 34.54,63.64 R10.2
CANH  (via drill 0.45)
  Top 0.406: BUS1.4 48.74,106.93 40.39,106.93 39.05,108.27 BUS2.4 | v30.07,105.21 27.38,102.51 27.38,97.74 25.25,95.61 v25.25,91.16 | v15.49,56.13 15.24,56.39 12.83,56.39 11.94,57.28 11.94,58.42 15.37,61.85 15.37,71.37 v16.89,72.9 | v20.45,83.44 v20.45,76.45
  Bottom 0.406: X4.8 36.7,126.85 36.7,114.3 | 36.7,114.3 39.05,111.95 BUS2.4 | CAN_TRANSCEIVER.7 10.67,53.72 11.3,53.09 14.09,53.09 R15.1 15.49,54.49 v15.49,56.13 | 36.7,114.3 36.7,108.84 33.07,105.21 v30.07,105.21 | v25.25,91.16 24.18,90.09 21.51,90.09 20.45,89.03 v20.45,83.44 | v20.45,76.45 v16.89,72.9
CANL  (via drill 0.45)
  Top 0.406: v29.67,106.32 26.57,103.23 26.57,98.09 24.28,95.81 v24.28,91.77 | v10.31,57.45 10.31,57.94 14.48,62.1 14.48,72.01 v15.37,72.9 | X4.7 25.15,126.92 25.15,115.82 28.45,112.52 32.51,112.52 | 32.51,112.52 34.34,110.69 v34.34,108.92 | BUS2.3 39.14,112.52 | 39.14,112.52 32.51,112.52 | 39.14,112.52 50.32,112.52 BUS1.3 | v19.05,83.44 v19.05,76.58
  Bottom 0.406: v10.31,57.45 9.4,56.54 CAN_TRANSCEIVER.6 9.4,53.59 10.67,52.32 12.7,52.32 13.85,51.17 R15.2 | v29.67,106.32 33.02,106.32 34.34,107.64 v34.34,108.92 | v24.28,91.77 23.27,90.75 21.18,90.75 19.68,89.26 19.68,84.45 19.05,83.82 v19.05,83.44 | v19.05,76.58 v15.37,72.9
FAN1-
  Top 1.778: X3.8 33.81,12.29 35.94,10.16 62.87,10.16 72.9,20.19 72.9,57.15 68.03,62.02 U$7.P
FAN2-  (via drill 1.27)
  Top 1.778: X3.9 37.4,4.32 64.9,4.32 v68.14,7.56 | U$2.P 64.77,41.99 v64.77,32.26
  Bottom 1.778: v68.14,7.56 68.14,28.89 v64.77,32.26
GND  (via drill 0.45, 0.6)
  Top 0.406: R22.1 R23.1 75.18,126.88 v76.83,125.22 | v76.83,122.56 78.7,120.69 C3.2 | v69.22,113.16 REG1.1 | REG.2 11.43,45.59 v12.32,46.48 | LED6.C v25.02,110.74 | v13.84,54.74 11.18,52.07 v9.65,52.07 | 33.51,107.04 33.38,107.04 29.84,103.5 LED5.C 28.32,94.78 28.32,83.98 LED7.C | 12.45,46.61 v12.32,46.48 | C1.1 v12.33,46.49 v12.32,46.48 | 40.64,56.99 LED4.C
  Top 0.61: REG1.1 71.42,110.33 C4.1 71.86,108.84 REG2.4 | REG2.4 REG2.2 73.91,97.54 | REG.2 REG.4 v11.43,35.05 | C2.1 8.37,35.05 v11.43,35.05 | v25.02,110.74 29.8,110.74 X1.2 | 12.7,22.48 18.67,22.48 | 12.7,22.48 11.34,22.48 LED14.C 11.54,25.48 v11.54,27.16 | 18.67,22.48 25.78,22.48 | 25.78,22.48 43.94,22.48 | 43.94,22.48 44.99,23.53 LED3.C | 25.78,22.48 26.58,23.27 LED9.C | LED15.C 19.21,23.02 18.67,22.48 | LED8.C 14.86,20.32 12.7,22.48 | 59.05,86.88 R27.2 68.2,86.88 U$6.1 | 59.05,86.88 IMD_SHUTDOWN.COIL+ 60.2,90.3 60.2,97.92 57.67,100.44 | 59.05,86.88 59.94,85.98 59.94,75.31 58.42,73.79 IMD_SHUTDOWN1.COIL+ 57.91,72.26 59.94,70.23 | 62.67,68.02 U$7.1 | 62.67,68.02 R28.2 | 73.91,97.54 C6.1 | 73.91,97.54 C5.1 | BUS1.2 52.7,100.44 57.67,100.44 | 57.67,100.44 XB.10 67.57,100.44 REG2.4 | S1.B2 S1.B1 48.01,54.19 46.45,55.75 R18.2 45.46,55.77 R19.2 41.56,57.91 LED4.C | S1.B2 59.35,55.16 59.94,55.75 59.94,70.23 | v11.43,35.05 11.43,30.23 v11.56,30.1 | 59.94,70.23 62.16,68.02 62.67,68.02 | S1.B2 62.61,50.93 R24.2 62.75,49.43 U$2.1 71.12,46.63 71.12,35.81 57.78,22.48 43.94,22.48
  Top 2.032: BUS1.2 47.73,105.41 41.54,105.41 BUS2.2 37.63,102.91 33.51,107.04 X1.2
  Bottom 0.406: v76.83,125.22 v76.83,122.56 76.83,120.78 v69.22,113.16 | R9.1 12.32,42.16 v12.32,46.48 10.67,48.13 CAN_TRANSCEIVER.2 10.67,51.05 v9.65,52.07 | R2.2 R4.2 R6.2 R8.2 15.88,58.42 12.63,55.18 | 12.63,55.18 CAN_TRANSCEIVER.8 | 12.63,55.18 13.07,54.74 v13.84,54.74
  Bottom 0.61: D4.A 19.18,106.82 U$1.2 23.77,109.5 v25.02,110.74 | U$6.1 70.25,84.83 D7.A | U$7.1 70.22,66.11 D8.A | D6.A IMD_SHUTDOWN.COIL+ | D5.A IMD_SHUTDOWN1.COIL+ | U$3.AGND 8,35.05 v11.43,35.05 18.41,35.05 U$3.GND | v11.54,27.16 11.54,30.08 v11.56,30.1 | U$2.1 70.36,47.4 D9.A
  Bottom 1.778: 32.13,122.07 X4.3
  Bottom 2.032: 32.13,122.07 X1.2
  Bottom 2.286: X4.6 17.61,129.75 13.34,125.48 13.34,121.79 15.49,119.63 29.69,119.63 X4.3
GND1
  Bottom 2.032: U$6.S 84.2,71.08 84.2,52.34 | U$7.S 81.05,56.03
  Bottom 2.54: U$2.S 84.2,41.12 84.2,52.34 U$7.S
  Bottom 3.302: X3.10 31.69,4.19 69.46,4.19 80.51,15.24 U$2.S
GPIO_1  (via drill 0.45)
  Top 0.406: v7.62,26.29 GPIO_SSR1.3 7.88,28.26 U$10.2 | v20.32,17.14 v16.89,20.57 | v30.99,18.41 v30.99,15.49
  Bottom 0.406: X3.6 42.86,16.38 30.1,16.38 | 30.1,16.38 21.08,16.38 v20.32,17.14 | 9.53,26.29 v7.62,26.29 13.34,20.57 v16.89,20.57 | X2.6 56.91,57.54 39.5,40.13 38.35,40.13 36.58,38.35 36.58,27.56 30.99,21.97 v30.99,18.41 | v30.99,15.49 30.1,16.38
GPIO_2  (via drill 0.45)
  Top 0.406: GPIO_SSR2.3 17.15,28.26 U$11.2 17.14,31.12 v17.14,40.64 | v14.99,49.14 11.05,49.14 8.13,52.07 8.13,53.98 v6.48,55.63 | v6.48,58.17 6.48,66.67 5.84,67.31 5.84,68.2 6.48,68.83 6.48,69.98 5.59,70.87 v4.32,70.87 | X4.9 36.81,132.59 20.57,132.59 19.56,131.57 v19.56,127.76 | v19.56,121.92 v19.56,117.47
  Bottom 0.406: v17.14,40.64 14.99,42.8 v14.99,49.14 | v6.48,55.63 v6.48,58.17 | v4.32,70.87 1.78,73.41 1.78,101.09 7.24,106.55 8.64,106.55 v19.56,117.47 | v19.56,127.76 v19.56,121.92
GPIO_CTRL1
  Top 0.406: U$3.A4 2.41,54.61 2.41,34.53 U$10.1 5.83,30.8 GPIO_SSR1.1
GPIO_CTRL2  (via drill 0.45)
  Top 0.406: GPIO_SSR2.1 15.1,30.8 U$11.1 15.1,41.9 v16.13,42.93
  Bottom 0.406: v16.13,42.93 18.29,45.09 21.46,45.09 22.99,46.61 22.99,50.16 21.72,51.44 U$3.D5
IMD_COIL_PWR  (via drill 0.6)
  Top 0.61: IMD_SHUTDOWN.4 29.85,88.01 R14.1 | v34.8,73.91 34.8,72.14 37.08,69.85 42.04,69.85 v44.07,67.82 | v44.07,62.87 v44.07,60.58 | IMD_LATCH_SSR.3 37.04,25.78 v36.2,25.78 | v35.31,54.23 37.59,51.94 v37.59,37.97
  Bottom 0.61: D6.C IMD_SHUTDOWN.COIL- 54.67,92.27 38.67,92.27 34.42,88.01 IMD_SHUTDOWN.4 34.8,86.11 v34.8,73.91 | v44.07,67.82 v44.07,62.87 | v44.07,60.58 38.86,55.37 36.45,55.37 v35.31,54.23 | v37.59,37.97 37.59,27.18 v36.2,25.78
IMD_PWR_STEP  (via drill 0.6)
  Top 0.61: IMD_LATCH_SSR.4 v34.16,28.83 | v28.83,24.89 28.53,25.19 IMD_SSR.3 | v45.47,68.33 42.93,70.87 37.72,70.87 35.94,72.65 v35.94,73.03 | v45.47,60.33 v45.47,62.87
  Bottom 0.61: v28.83,24.89 32.77,28.83 v34.16,28.83 34.42,29.08 34.42,49.28 v45.47,60.33 | IMD_SHUTDOWN.3 35.94,86.06 v35.94,73.03 | v45.47,62.87 v45.47,68.33
INVERTER_CTRL  (via drill 0.45)
  Top 0.406: v15.37,105.41 12.06,102.11 v12.06,95.76 | v8.76,92.46 9.12,92.1 9.12,77.06 2.41,70.36 2.41,58.55 3.17,57.78 5.46,57.78 6.72,56.53 11.04,56.53 11.94,55.63 14.61,55.63 16.26,53.98 U$3.D6
  Bottom 0.406: INVERTER_SSR.1 14.86,104.9 v15.37,105.41 | v12.06,95.76 v8.76,92.46
INVERTER_SUPPLY  (via drill 1.14)
  Top 1.778: U$1.S 10.46,106.02 10.46,76.78 12.57,74.68 19.18,74.68 29.34,64.52 v31.62,64.52 49.83,64.52 X2.5
  Bottom 1.778: v31.62,64.52 31.62,38.73 22.1,29.21 22.1,19.77 X3.5
LATCH_EXT_BUTTON  (via drill 0.45)
  Top 0.406: LED2.C 54.39,25.37 52.58,27.18 47.12,27.18 | LED1.C 37.08,24.13 40.13,27.18 47.12,27.18 | v48.9,31.11 48.9,28.96 47.12,27.18 | v51.4,41.02 S1.A1 S1.A2 v60.71,51.05
  Bottom 0.406: v48.9,31.11 48.9,31.37 51.4,33.87 v51.4,41.02 | X4.10 54.72,120.52 64.14,120.52 65.15,119.51 65.15,89.92 61.72,86.49 61.72,52.07 v60.71,51.05
N$1
  Top 0.406: LED1.A 31.54,26.08 IMD_LATCH_SSR.2
N$2  (via drill 0.45)
  Top 0.406: U$3.D4(CANRX) 18.92,48.26 10.79,48.26 6.99,52.07 v6.99,53.21
  Bottom 0.406: v6.99,53.21 8.13,52.07 CAN_TRANSCEIVER.4
N$3
  Bottom 0.406: CAN_TRANSCEIVER.1 15.94,49.98 U$3.D3(CANTX)
N$4
  Bottom 0.61: U$6.2 70.25,76.64 D7.C 71.22,80.77 76.33,80.77 77.6,82.04 PUMP_SSR.3
N$5
  Top 0.406: IMD_LATCH_SSR.1 33.52,30.8 R12.1
N$6
  Top 0.406: GPIO_SSR1.2 3.8,26.23 R29.1
N$7
  Top 0.406: LED4.A 38.7,59.98 BRAKE_LIGHT_SSR.2
N$8
  Top 0.406: GPIO_SSR2.2 13.13,23.93 R30.1
N$9
  Top 0.406: BMS_SSR.2 40.94,26.08 LED3.A
N$10
  Top 0.406: XB.15 84.09,108.44 83.31,109.22 83.31,125.48 84.33,126.49 LED10.A
N$11
  Top 0.406: R22.2 82.13,128.18 LED10.C
N$12
  Top 0.406: BMS_LATCH_SSR.1 52.31,30.8 R13.2
N$13
  Top 0.406: R29.2 LED14.A
N$14
  Top 0.406: R30.2 LED15.A
N$15
  Bottom 0.406: R9.2 BOARD_TEMP.2 8.75,47.13 7.11,48.77 7.11,51.69 4.83,53.98 U$3.A5
N$16
  Top 0.406: LED2.A 50.34,26.08 BMS_LATCH_SSR.2
N$17
  Bottom 0.406: R10.1 BRAKE_LIGHT_SSR.1
N$18
  Top 0.406: BMS_SSR.1 42.92,30.8 R11.1
N$19
  Top 0.61: R14.2 LED5.A
N$20
  Bottom 0.61: U$7.2 70.22,57.93 D8.C 71.31,62.1 76.2,62.1 77.47,63.37 FAN_SSR1.3
N$21
  Bottom 0.61: FAN_SSR2.3 77.47,44.7 76.2,43.43 71.26,43.43 D9.C 70.36,39.47 U$2.2
N$22  (via drill 0.45)
  Top 0.406: v11.56,69.47 11.56,67.44 v12.32,66.67
  Bottom 0.406: v12.32,66.67 R1.1 | D1.C v11.56,69.47
N$23  (via drill 0.45)
  Top 0.406: v6.86,67.56 10.29,64.14 v12.32,64.14
  Bottom 0.406: v12.32,64.14 R3.1 | D2.C v6.86,67.56
N$24  (via drill 0.45)
  Top 0.406: v13.34,69.6 13.34,62.61 v12.32,61.59
  Bottom 0.406: R5.1 v12.32,61.59 | v13.34,69.6 D3.C
N$25
  Top 0.406: XB.6 60.96,110.37 60.96,119.13 68.2,126.37 LED11.A
N$26
  Bottom 0.61: U$1.1 19.18,100.19 D4.C 15.86,103.5 9.06,103.5 INVERTER_SSR.3
N$27  (via drill 0.45)
  Top 0.406: v23.11,101.09 24.9,99.31 R16.1
  Bottom 0.406: v23.11,101.09 23.11,98.17 20.95,96.01 17.53,96.01 16.26,97.28 16.26,100.03 INVERTER_SSR.2
N$28
  Top 0.406: LED6.A R16.2
N$29
  Top 0.406: R20.2 16.74,15.21 LED8.A
N$30
  Top 0.406: R24.1 LED16.C
N$31
  Top 0.406: IMD_SSR.1 24.5,30.8 R21.2
N$32
  Top 0.61: R17.2 LED7.A
N$33
  Top 0.406: LED11.C 73.24,128.16 R23.2
N$34
  Top 0.406: IMD_SSR.2 22.53,26.08 LED9.A
N$35
  Top 0.406: C3.1 76.21,113.34 REG1.3 | C6.2 78.36,98.67 78.36,101.73
  Top 0.61: REG1.3 78.36,110.82 78.36,101.73 77.11,100.48 REG2.3
N$36
  Top 0.406: R28.1 LED13.C
N$37
  Top 0.406: R27.1 LED12.C
N$38  (via drill 0.45)
  Top 0.406: LED12.A 62.48,73.91 v62.74,73.66
  Bottom 0.406: PUMP_SSR.2 73.33,85.04 69.85,88.52 66.93,88.52 62.74,84.33 v62.74,73.66
N$39  (via drill 0.45)
  Top 0.406: v62.61,36.58 LED16.A
  Bottom 0.406: FAN_SSR2.2 73.2,47.96 69.85,51.31 64.52,51.31 62.61,49.4 v62.61,36.58
N$42  (via drill 0.45)
  Top 0.406: v62.61,54.99 LED13.A
  Bottom 0.406: FAN_SSR1.2 73.2,66.5 69.98,69.72 66.55,69.72 62.61,65.79 v62.61,54.99
OKHS  (via drill 0.45, 0.6)
  Top 0.406: R18.1 43.42,54.73 v42.8,54.1 | v28.26,32.07 27.5,32.07 R21.1 | v24.89,71.88 30.84,65.94 47.3,65.94 X2.1
  Top 0.61: v42.8,54.1 v37.34,54.1
  Bottom 0.406: D1.A 8.5,69.6 6.1,69.6 5.46,70.23 5.46,71.25 6.1,71.88 v24.89,71.88
  Bottom 0.61: X2.1 50.67,64.97 50.67,60.71 44.07,54.1 v42.8,54.1 | v37.34,54.1 33.27,50.04 33.27,37.08 v28.26,32.07 24.26,28.07 24.26,22.1 25.02,21.34 25.02,18.16 25.91,17.27 43.02,17.27 X3.1
OKHS_READ
  Bottom 0.406: R2.1 13.84,66.68 13.84,67.56 13.46,67.94 9.27,67.94 8.88,67.56 R1.2 U$3.A0
PUMP1-  (via drill 1.27)
  Top 1.778: U$6.P 68.11,80.74 76.2,72.64 76.2,19.94 63.63,7.37 v42.42,7.37
  Bottom 1.778: v42.42,7.37 39.65,10.13 X3.7
RELAY_CTRL1  (via drill 0.45)
  Top 0.406: U$3.A9 5.46,43.81 9.27,47.62 20.7,47.62 21.72,48.64 v21.72,52.7 | v62.87,72.01 v59.82,72.01
  Bottom 0.406: v21.72,52.7 21.72,56.52 25.02,59.82 25.02,64.01 30.61,69.6 47.62,69.6 48.13,70.1 57.91,70.1 v59.82,72.01 | PUMP_SSR.1 73.33,75.87 69.6,72.14 69.47,72.01 v62.87,72.01
RELAY_CTRL2  (via drill 0.45)
  Top 0.406: v56.13,33.78 55.88,33.53 38.61,33.53 37.72,34.42 24.26,34.42 22.23,36.45 22.23,42.16 v22.48,42.42
  Bottom 0.406: FAN_SSR1.1 73.2,57.45 69.85,54.1 65.79,54.1 61.47,49.78 61.47,45.72 56.13,40.39 v56.13,33.78 | v22.48,42.42 21.08,43.81 U$3.D2
RELAY_CTRL3  (via drill 0.45)
  Top 0.406: v4.95,33.91 v7.62,33.91 | v24.45,36.01 57.47,36.01 v57.66,35.81
  Bottom 0.406: U$3.A8 2.41,44.45 2.41,35.69 4.19,33.91 v4.95,33.91 | v7.62,33.91 22.35,33.91 v24.45,36.01 | FAN_SSR2.1 73.2,38.4 69.34,34.54 58.93,34.54 v57.66,35.81
SHUTDOWN_A
  Bottom 1.778: SHUTDWN_FUSE.L1 SHUTDWN_FUSE.L2 10.29,81.41 24.51,81.41 29.97,86.87 29.97,89.66 32.13,91.82 34.21,91.82 IMD_SHUTDOWN.6
SHUTDOWN_B
  Top 2.032: IMD_SHUTDOWN.5 35.43,92.96 35.43,85.6 37.9,83.13 IMD_SHUTDOWN1.6
SHUTDOWN_C
  Top 1.778: X2.3 56.91,68.7 48.01,77.6 37.47,77.6 36.58,77.6 34.42,77.6 32.89,79.12 IMD_SHUTDOWN1.5
  Bottom 0.406: D3.A 17.92,67.94 23.88,67.94 27.56,71.63 27.56,75.95 IMD_SHUTDOWN1.5
  Bottom 1.778: X3.3 39.23,25.16 39.23,37.19 59.56,57.53 59.56,64.9 57.32,67.14 X2.3
SHUTDOWN_OUT_READ
  Bottom 0.406: U$3.A2 R5.2 8.88,62.35 9.4,62.87 13.34,62.87 13.83,62.37 R6.1
VCC
  Top 0.406: REG1.2 73.72,109.96 C4.2
  Top 0.61: XB.1 72.71,118.44 REG1.4 REG1.2
XB8  (via drill 0.45)
  Top 0.406: v51.69,94.49 49.91,92.71 v49.91,90.81
  Bottom 0.406: XB.4 60.96,110.51 60.96,103.76 v51.69,94.49 | v49.91,90.81 49.91,75.06 45.21,70.36 30.1,70.36 24.13,64.39 24.13,60.2 20.45,56.52 U$3.D7(RX3)
XBDI  (via drill 0.45)
  Top 0.406: v22.99,64.14 U$3.D10(TX2) | v50.29,95.25 48.51,93.47 v48.51,90.81
  Bottom 0.406: XB.3 60.07,111.62 60.07,104.14 51.18,95.25 v50.29,95.25 | v48.51,90.81 48.51,74.93 44.7,71.25 29.59,71.25 22.99,64.52 v22.99,64.14
XBDO  (via drill 0.45)
  Top 0.406: v49.15,96.27 47.12,94.23 v47.12,90.81
  Bottom 0.406: XB.2 59.18,112.73 59.18,104.52 50.93,96.27 v49.15,96.27 | v47.12,90.81 47.12,74.8 44.32,72.01 29.21,72.01 21.84,64.64 21.84,62.48 20.95,61.59 U$3.D9(RX2)

### Text on the board
tDocu: FSAE Fuse | FH Fuse | Inverter Power Relay | Cherkbot approved | Shutdown | Front | Accum | Pump1 | Fan1 | Latch BTN | Fan2 | Designed by Nathan Cheek | IMD | IMD LATCH | BMS | BMS Latch | GPIO1 | GPIO2 | 5V Power | 2018 Rear ECU rev5